# EAGLE design TOPCPCB (EAGLE 9.4.2)
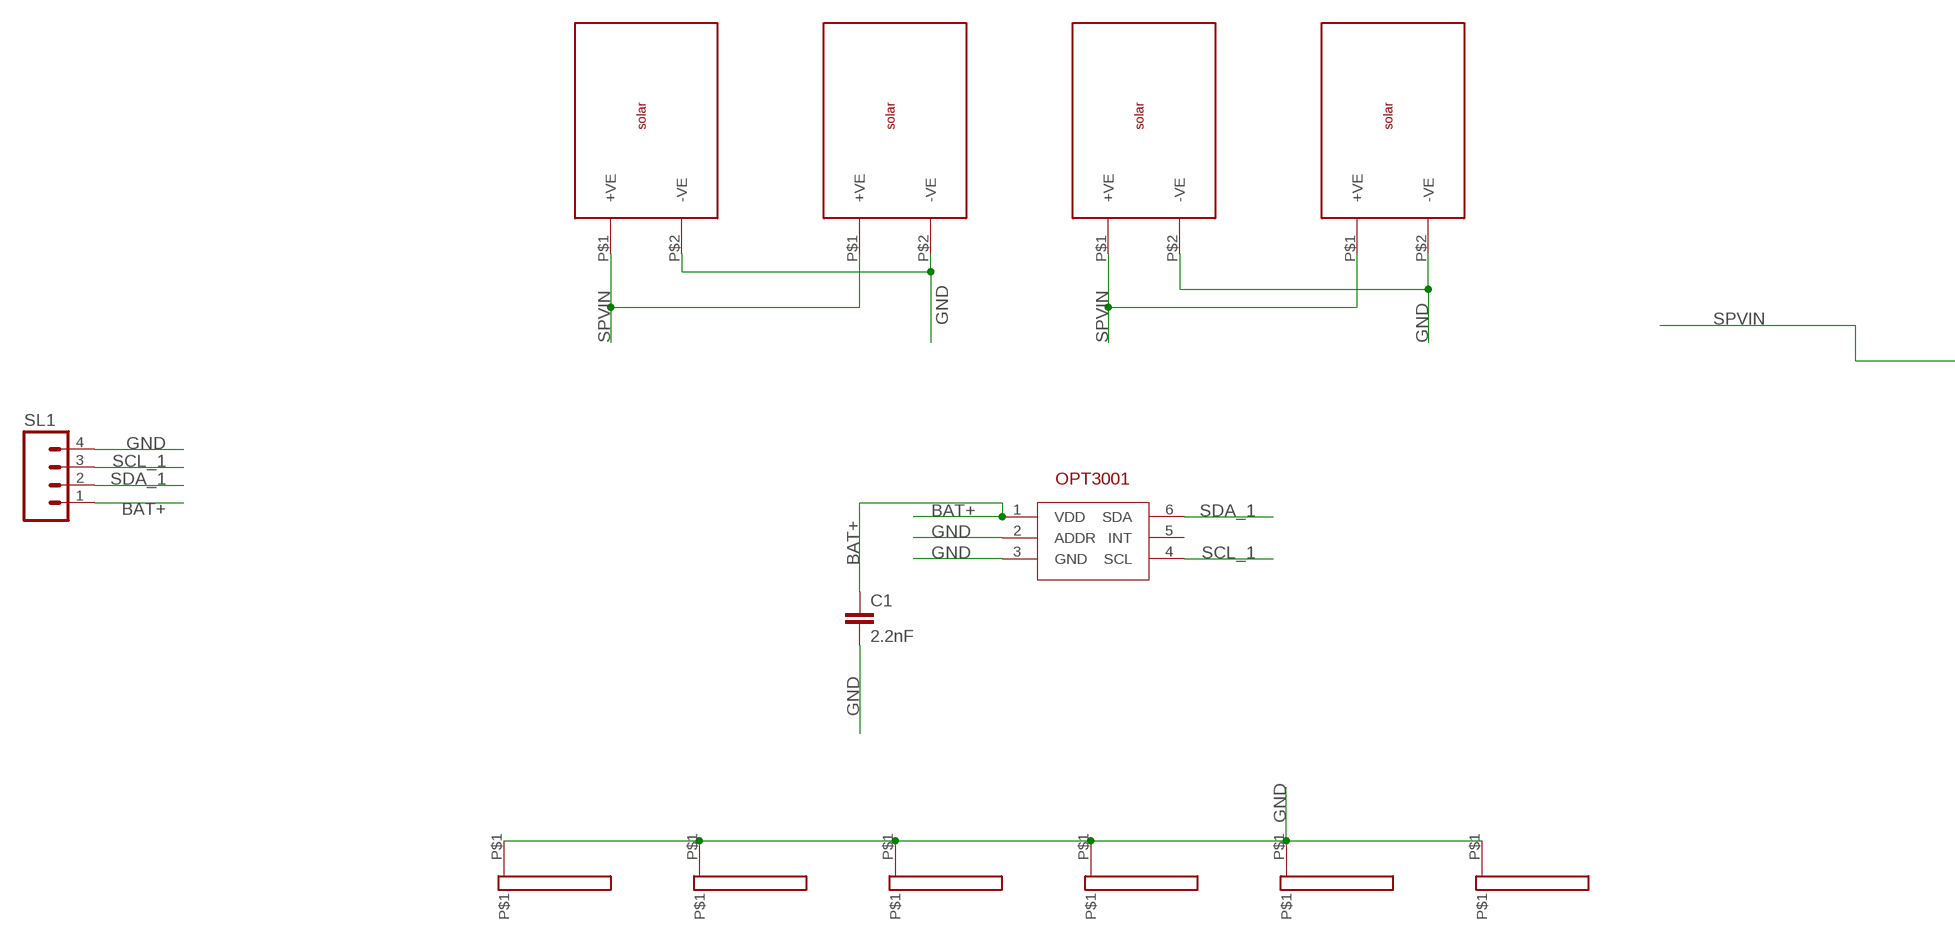
[diagram p0: schematic, sheet 1, part 1 of 2]
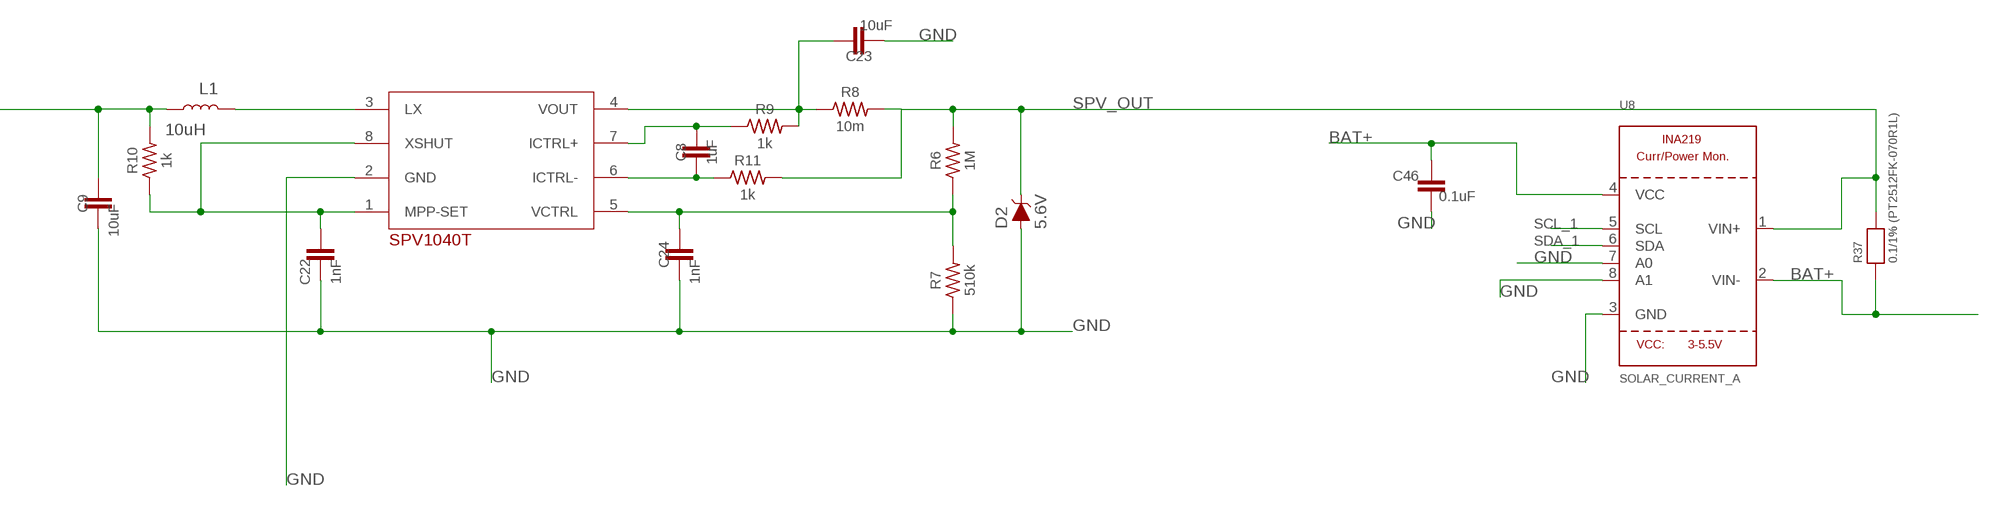
[diagram p1: schematic, sheet 1, part 2 of 2]

## Parts
C1  2.2nF  2.2NF/2200PF-0603-50V-10%  [0603]
C8  1uF  10UF-0603-6.3V-20%  [0603]
C9  10uF  10UF-0603-6.3V-20%  [0603]
C22  1nF  10UF-0603-6.3V-20%  [0603]
C23  10uF  10UF-0603-6.3V-20%  [0603]
C24  1nF  10UF-0603-6.3V-20%  [0603]
C46  0.1uF  10UF-0603-6.3V-20%  [0603]
D2  5.6V  DIODE-ZENER-MMSZ5232BS  [SOD-323]
L1  10uH  INDUCTOR-0603-33NH  [0603]
LEFTSOLD  16X2  [16X2]
R6  1M  RC0603JR-070RL  [RES_0603]
R7  510k  RC0603JR-070RL  [RES_0603]
R8  10m  RC0603JR-070RL  [RES_0603]
R9  1k  RC0603JR-070RL  [RES_0603]
R10  1k  RC0603JR-070RL  [RES_0603]
R11  1k  RC0603JR-070RL  [RES_0603]
R37  0.1/1% (PT2512FK-070R1L)  RESISTOR2512  [2512]
SL1  M04  [04P]
SPV_A  SPV1040T_  [SOP65P640X120-8N]
U1  SON65P200X200X65-7N  [SON65P200X200X65-7N]
U8  SOLAR_CURRENT_A  INA219  [SOT23-8]
U$1  16X2  [16X2]
U$4  16X2  [16X2]
U$5  16X2  [16X2]
U$7  16X2  [16X2]
U$9  16X2  [16X2]
U$10  SOLAR_50_5_2  [FOOT]
U$11  SOLAR_50_5_2  [FOOT]
U$12  SOLAR_50_5_2  [FOOT]
U$13  SOLAR_50_5_2  [FOOT]

## Nets
BAT+: C1.1 C46.1 R37.1 SL1.1 U1.1(VDD) U8.2(VIN-) U8.4(VCC)
GND [vcc]: C1.2 C9.2 C22.2 C23.2 C24.2 C46.2 D2.A LEFTSOLD.P$1 R7.1 SL1.4 SPV_A.2(GND) U1.2(ADDR) U1.3(GND) U8.3(GND) U8.7(A0) U8.8(A1) U$1.P$1 U$4.P$1 U$5.P$1 U$7.P$1 U$9.P$1 U$10.P$2(-VE) U$11.P$2(-VE) U$12.P$2(-VE) U$13.P$2(-VE)
N$5: L1.2 SPV_A.3(LX)
N$31: C22.1 R10.1 SPV_A.1(MPP-SET) SPV_A.8(XSHUT)
N$32: C24.1 R6.1 R7.2 SPV_A.5(VCTRL)
N$34: C8.2 R11.1 SPV_A.6(ICTRL-)
N$35: C8.1 R9.1 SPV_A.7(ICTRL+)
N$36: C23.1 R8.1 R9.2 SPV_A.4(VOUT)
SCL_1: SL1.3 U1.4(SCL) U8.5(SCL)
SDA_1: SL1.2 U1.6(SDA) U8.6(SDA)
SPV_OUT: D2.C R6.2 R8.2 R11.2 R37.2 U8.1(VIN+)
SPVIN: C9.1 L1.1 R10.2 U$10.P$1(+VE) U$11.P$1(+VE) U$12.P$1(+VE) U$13.P$1(+VE)
Unconnected: U1.5(INT)

## Library data of the parts
C1 = SparkFun-Capacitors:2.2NF/2200PF: 2.2nF/2,200pF ceramic capacitors A capacitor is a passive two-terminal electrical component used to store electrical energy temporarily in an electric field.; PROD_ID: CAP-07877
C8 C22 C24 C46 = SparkFun-Capacitors:10UF: 10.0µF ceramic capacitors A capacitor is a passive two-terminal electrical component used to store electrical energy temporarily in an electric field.; PROD_ID: CAP-11015; VALUE: 10uF
C9 C23 = SparkFun-Capacitors:10UF: 10.0µF ceramic capacitors A capacitor is a passive two-terminal electrical component used to store electrical energy temporarily in an electric field.; PROD_ID: CAP-11015
D2 = SparkFun-DiscreteSemi:DIODE-ZENER: Zener Diode A Zener diode allows current to flow from its anode to its cathode like a normal semiconductor diode, but it also permits current to flow in the reverse direction when its "Zener voltage" is reached. - WIkipedia; PROD_ID: DIO-12442
L1 = SparkFun-Coils:INDUCTOR: Inductors Resist changes in electrical current. Basically a coil of wire. SparkFun Products: SparkFun Load Cell Amplifier - HX711 <https://www.sparkfun.com/products/13879> IOIO-OTG - V2.2 <https://www.sparkfun.com/products/13613>; PROD_ID: NDUC-07874; VALUE: 33nH/±5%/500mA
LEFTSOLD U$1 U$4 U$5 U$7 U$9 = 16x2PAD:16X2: Pad for 90 degree solder
R6-R11 = Resistor_Capacitor:RC0603JR-070RL: RES SMD 0 OHM JUMPER 1/10W 0603 Manufacturer's datasheet <http://www.yageo.com/documents/recent/PYu-RC_Group_51_RoHS_L_10.pdf>; CREATED_BY: PCBLayout.com; DIGIKEY_PART_NUMBER: 311-0.0GRTR-ND; MANUFACTURER: Yageo; MPN: RC0603JR-070RL; PACKAGE: SMD 0603
R37 = microbuilder:RESISTOR: Resistors 0402 - 0402 Surface Mount Package 22 Ohm 1% 1/16W [Digikey: 311-22.0LRTR-ND] 33 Ohm 5% 1/16W 1.0K 5% 1/16W 1.5K 5% 1/16W 2.0K 1% 1/16W 10.0K 1% 1/16W [Digikey: 311-10.0KLRTR-ND] 10.0K 5% 1/16W [Digikey: RMCF0402JT10K0TR-ND] 12.1K 1% 1/16W [Digikey: 311-22.0LRTR-ND] 100.0K 5% 1/16W 0603 - 0603 Surface Mount Package 0 Ohm 1/10 Watt 1% Resistor 15 Ohm 1/10 Watt 1% Resistor 33 Ohm 1/10 Watt 1% Resistor 49.9 Ohm 1/10 Watt 1% Resistor 100 Ohm 1/10 Watt 1% Resistor 150 Ohm 1/10 Watt 1% Resistor 240 Ohm 1/10 Watt 1% Resistor 390 Ohm 1/10 Watt 1% Resistor 560 Ohm 1/10 Watt 1% Resistor 680 Ohm 1/10 Watt 1% Resistor 750 Ohm 1/10 Watt 1% Resistor 1.0K Ohm 1/10 Watt 1% Resistor 1.5K Ohm 1/10 Watt 1% Resistor 2.0K Ohm 1/10 Watt 1% Resistor 2.2K Ohm 1/10 Watt 1% Resistor 3.3K Ohm 1/10 Watt 1% Resistor 4.7K Ohm 1/10 Watt 1% Resistor 10.0K Ohm 1/10 Watt 1% Resistor 12.0K Ohm 1/10 Watt 1% Resistor 12.1K Ohm 1/10 Watt 1% Resistor 20.0K Ohm 1/10 Watt 1% Resistor 33.0K Ohm 1/10 Watt 1% Resistor 100.0K Ohm 1/10 Watt 1% Resistor 0805 - 0805 Surface Mount Package 0 Ohm 1/8 Watt 1% Resistor 33 Ohm 1/8 Watt 1% Resistor 100 Ohm 1/8 Watt 1% Resistor 150 Ohm 1/8 Watt 1% Resistor 200 Ohm 1/8 Watt 1% Resistor 240 Ohm 1/8 Watt 1% Resistor 330 Ohm 1/8 Watt 1% Resistor 390 Ohm 1/8 Watt 1% Resistor 470 Ohm 1/8 Watt 1% Resistor 1.0K Ohm 1/8 Watt 1% Resistor 1.5K Ohm 1/8 Watt 1% Resistor 2.0K Ohm 1/8 Watt 1% Resistor 4.7K Ohm 1/8 Watt 1% Resistor 5.1K Ohm 1/8 Watt 1% Resistor 5.6K Ohm 1/8 Watt 1% Resistor 10.0K Ohm 1/8 Watt 1% Resistor 22.0K Ohm 1/8 Watt 1% Resistor 33.0K Ohm 1/8 Watt 1% Resistor 100K Ohm 1/8 Watt 1% Resistor 1206 - 1206 Surface Mount Package 2012 - 2010 Surface Mount Package 0.11 Ohm 1/2 Watt 1% Resistor - Digikey: RHM.11UCT-ND
SL1 = con-amp-quick:M04: AMP QUICK CONNECTOR; OC_FARNELL: unknown; OC_NEWARK: unknown
SPV_A = SPV1040T:SPV1040T_
U1 = SON65P200X200X65-7N:SON65P200X200X65-7N; A_MAX: 0.65; B_MAX: 0.3; B_MIN: 0.2; B_NOM: 0.25; D2_NOM: 1.35; D_MAX: 2.075; D_MIN: 1.925; D_NOM: 2.0; E2_NOM: 0.65; ENOM: 0.65; E_MAX: 2.075; E_MIN: 1.925; E_NOM: 2.0; L_MAX: 0.35; L_MIN: 0.25; L_NOM: 0.3; MANUFACTURER: Maxim Integrated; PIN_COUNT: 6.0; SNAPEDA_PACKAGE_ID: 71138; STANDARD: IPC 7351B
U8 = microbuilder:INA219: INA219 - I2C Current/Power Monitor Voltage Range: 0-26V Accuracy: 0.5% Temperature: -40°C - 125°C
U$10-U$13 = solar_50_5_2:SOLAR_50_5_2

## Net classes
1 vcc: width 0.254 mm

## Board
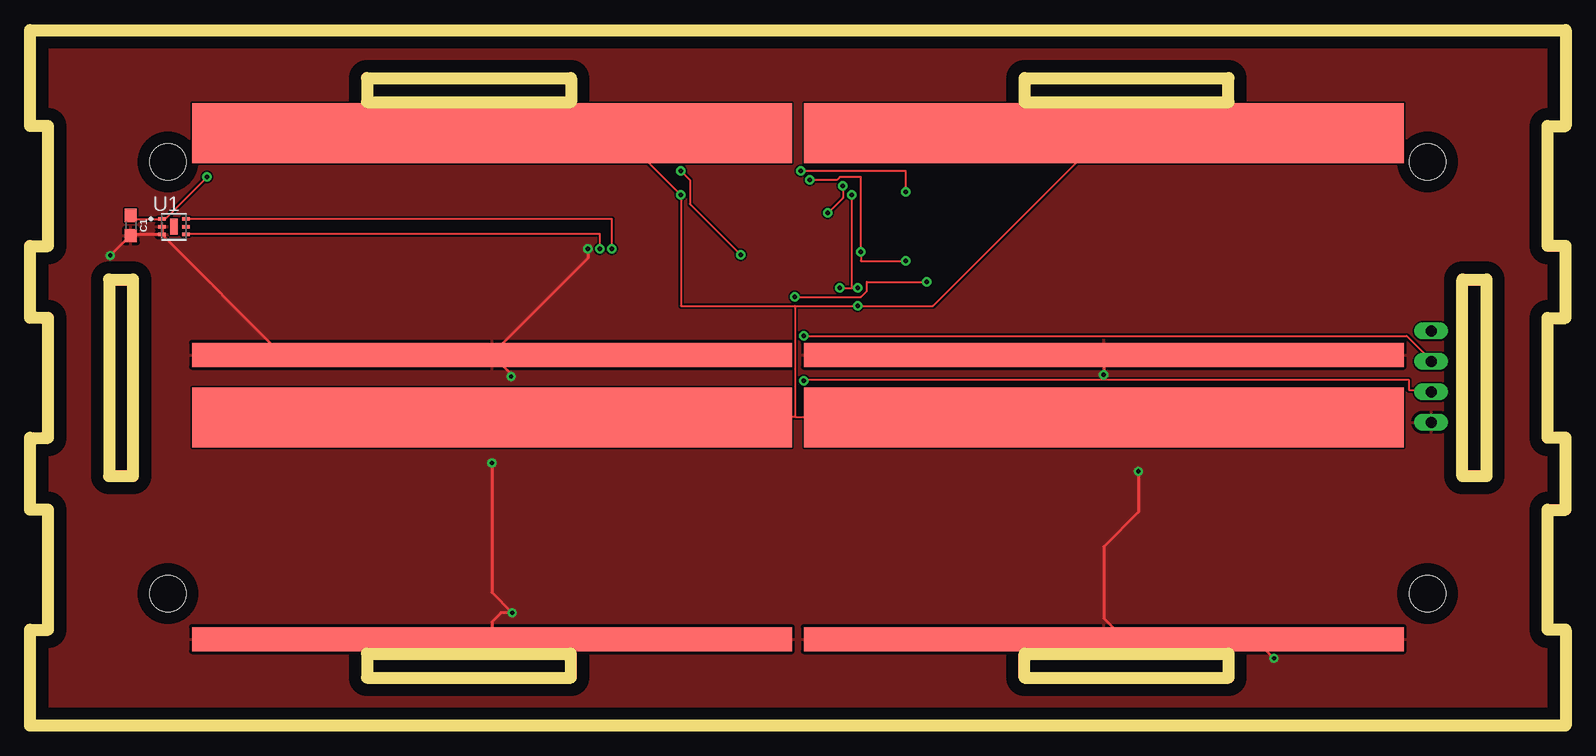
[diagram p2: board, top side]
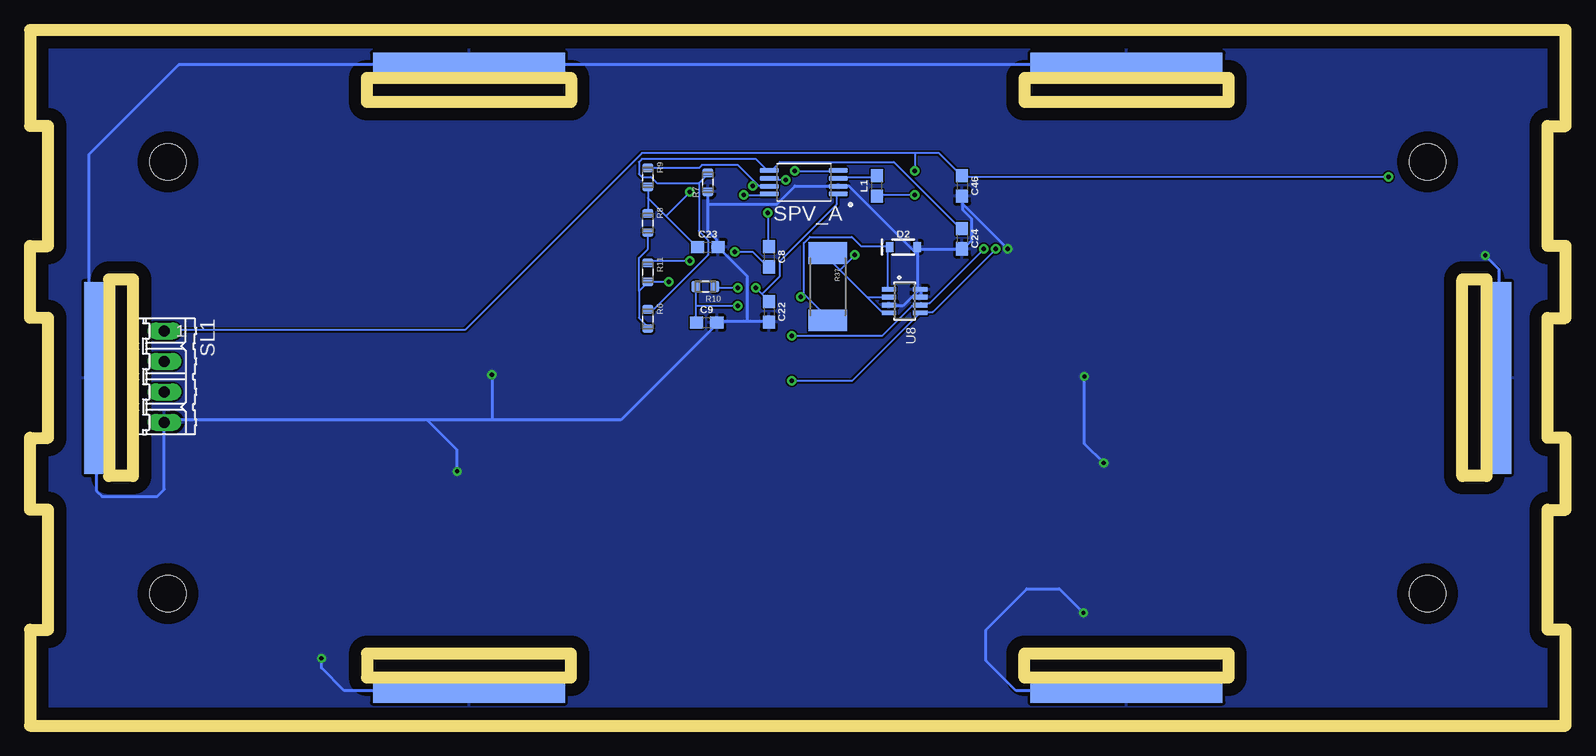
[diagram p3: board, bottom side, seen from below]

Size 128 x 58 mm. Coordinates in mm from the lower left corner, seen from the top.
Outline: 0,0 0,8 1.5,8 1.5,18 0,18 0,24 1.5,24 1.5,34 0,34 0,40 1.5,40 1.5,50 0,50 0,58 128,58 128,50 126.5,50 126.5,40 128,40 128,34 126.5,34 126.5,24 128,24 128,18 126.5,18 126.5,8 128,8 128,0 0,0
Outline: 8.6,20.8 8.6,37.2 6.6,37.2 6.6,20.8 8.6,20.8
Outline: 119.4,20.8 119.4,37.2 121.4,37.2 121.4,20.8 119.4,20.8
Outline: 82.9,52 99.9,52 99.9,54 82.9,54 82.9,52
Outline: 28.1,6 45.1,6 45.1,4 28.1,4 28.1,6
Outline: 82.9,6 99.9,6 99.9,4 82.9,4 82.9,6
Outline: 28.1,54 45.1,54 45.1,52 28.1,52 28.1,54
Copper layers (1*16): Top 0.035mm / dielectric 1.5mm / Bottom 0.035mm
Design rules "default": minimum track width 6mil, minimum drill 0.35mm, track to track 6mil, track to pad 6mil, pad to pad 6mil, via to via 6mil, smd to smd 6mil, copper to edge 40mil, drill to drill 6mil, minimum pad ring 10mil, minimum via ring 8mil, stop-mask expansion 4mil, vias tented up to drill 0mil, thermal gap 10mil
Holes 3 mm at 11.5,47 11.5,11 116.5,11 116.5,47

### Footprints (pad centres in the part's own frame; a part is rotated, then mirrored left to right if it is on the bottom)
0603 = smd 1.1 x 1: 1 -0.85,0; 2 0.85,0
SOD-323 = smd 0.63 x 0.83: A 1.15,0; C -1.15,0
16X2 = smd 16 x 2: P$1 0,0
RES_0603 = smd 0.74 x 0.93: 1 -0.795,0; 2 0.795,0
2512 = smd 1.8 x 3.2: 1 -2.8,0; 2 2.8,0
04P = drill 0.914 long: 1 -3.81,0; 2 -1.27,0; 3 1.27,0; 4 3.81,0
SOP65P640X120-8N = smd 1.56 x 0.41: 1 -2.88,0.975; 2 -2.88,0.325; 3 -2.88,-0.325; 4 -2.88,-0.975; 5 2.88,-0.975; 6 2.88,-0.325; 7 2.88,0.325; 8 2.88,0.975
SON65P200X200X65-7N = smd 0.72 x 0.27: 1 -0.995,0.65; 2 -0.995,0; 3 -0.995,-0.65; 4 0.995,-0.65; 5 0.995,0; 6 0.995,0.65 | smd 0.65 x 1.35: 7 0,0
SOT23-8 = smd 0.4 x 1.2: 1 -0.975,-1.3; 2 -0.325,-1.3; 3 0.325,-1.3; 4 0.975,-1.3; 5 0.975,1.3; 6 0.325,1.3; 7 -0.325,1.3; 8 -0.975,1.3
FOOT = smd 50 x 5: P$1 0,0 | smd 50 x 2: P$2 0,18.5

### Placement (x,y rotation side)
C1  8.4,41.7 270 top
C8  66.4,39.1 270 bottom
C9  71.6,33.6 0 bottom
C22  66.4,34.5 270 bottom
C23  71.5,39.9 0 bottom
C24  50.3,40.6 270 bottom
C46  50.3,45 270 bottom
D2  55.2,39.9 0 bottom
L1  57.4,45 90 bottom
LEFTSOLD  5.53,28.99 270 bottom
R6  76.5,33.9 270 bottom
R7  71.5,45.3 90 bottom
R8  76.5,41.9 270 bottom
R9  76.5,45.7 270 bottom
R10  71.7,36.6 180 bottom
R11  76.5,37.8 270 bottom
R37  61.5,36.6 270 bottom
SL1  116.8,29.1 270 bottom
SPV_A  63.5,45.3 180 bottom
U1  12,41.6 0 top
U8  55.1,35.4 270 bottom
U$1  122.47,28.99 270 bottom
U$4  36.6,2.9 0 bottom
U$5  36.6,55.1 0 bottom
U$7  91.4,2.9 0 bottom
U$9  91.4,55.1 0 bottom
U$10  38.5,49.4 180 top
U$11  38.5,25.7 180 top
U$12  89.5,49.4 180 top
U$13  89.5,25.7 180 top

### Tracks (layer width: path | path; a pad name or v marks a point on that pad's centre or on a via)
BAT+  (via drill 0.35)
  Top 0.152: C1.1 8.5,42.5 8.5,42.25 U1.1 11.25,42.25 v14.75,45.75 | v59.25,39.25 55,43.5 55,45.5 v54.25,46.25
  Bottom 0.152: 60.5,38 61.5,39 R37.1 | 60.5,38 58.25,35.75 | 58.25,35.75 57,34.5 56.5,34.5 U8.4 | 58.25,35.75 56.5,35.75 U8.2 | v14.75,45.75 50.25,45.75 C46.1 50.5,46 52.25,47.75 54.25,47.75 | 54.25,47.75 77,47.75 91.75,33 116.75,33 SL1.1 | v59.25,39.25 60.5,38 | 54.25,47.75 v54.25,46.25
GND  (via drill 0.35)
  Top 0.254: 11,41 11,41.5 U1.2 | 11,41 8.5,41 C1.2 8.35,40.85 v6.7,39.2 | 11,41 U1.3 20.95,31 38.5,31 | U$12.P$2 v89.5,29.25 | 38.5,31 46.5,39 v46.5,39.75 | 38.5,31 U$10.P$2 40.1,29.3 v40.1,29.1 | v38.5,21.9 38.5,11.1 v40.2,9.4 39.26,9.4 38.5,8.64 38.5,7.9 38.5,7.64 | v103.7,5.6 101.66,7.64 90.8,7.64 | 90.8,7.64 89.5,7.64 U$13.P$2 | v92.4,21.2 92.4,17.8 89.5,14.9 89.5,8.94 90.8,7.64 | 38.5,7.64 38.4,7.64 | U$11.P$2 38.5,7.64
  Bottom 0.254: 54,39.25 54,36.5 U8.8 | 54,39.25 54,39.75 | 54,39.75 C24.2 50.25,39.75 49.5,40.5 49.5,42.25 50.25,43 50.25,43.5 | 54,39.75 D2.A | 50.25,43.5 50.25,44 C46.2 | U8.7 53.75,35.75 53.75,36.25 U8.8 | U8.3 56.25,35 55.25,35 54,36.25 U8.8 | 54,39.25 59.75,45 60.5,45 SPV_A.2 60.75,45 64.25,45 65.75,43.5 71.5,43.5 | 68.25,33.75 70.75,33.75 C9.2 70.75,33.5 78.75,25.5 89.5,25.5 | 68.25,33.75 66.5,33.75 C22.2 | 71.5,43.5 71.5,41.25 70.75,40.5 70.75,40 C23.2 68.25,37.5 68.25,33.75 | 71.5,43.5 R7.1 | 89.5,25.5 94.9,25.5 | 94.9,25.5 116.75,25.5 SL1.4 116.8,19.7 117.4,19.1 122,19.1 122.47,19.57 U$1.P$1 123.04,28.99 123.04,47.66 115.6,55.1 U$9.P$1 U$5.P$1 | v89.5,29.25 89.5,25.5 | 50.25,43.5 v46.5,39.75 | v38.5,21.9 40.1,23.5 v40.1,29.1 | v92.4,21.2 92.4,23 94.9,25.5 | LEFTSOLD.P$1 5.53,38.03 v6.7,39.2 | U$4.P$1 45.8,2.9 48.3,5.4 48.3,8 44.9,11.4 42.2,11.4 v40.2,9.4 | U$7.P$1 101.8,2.9 103.7,4.8 v103.7,5.6
  pour Top: 1.5,0 1.5,58 126.5,58 126.5,50.1 126.5,0
  pour Bottom: 1.5,0 1.5,58 126.5,58 126.5,0
N$5
  Bottom 0.152: L1.2 57.5,45.75 60.5,45.75 SPV_A.3
N$31  (via drill 0.35)
  Top 0.152: v67.5,36.5 68.5,36.5 | 68.5,36.5 v69,36.5 | 68.5,36.5 v68.5,44.25
  Bottom 0.152: v69,36.5 70.75,36.5 R10.1 | 67,36 66.5,35.5 C22.1 | 67,36 v67.5,36.5 | 67,36 65.5,37.5 65.5,38.75 60.75,43.5 60.75,44.25 SPV_A.1 | v68.5,44.25 66.5,44.25 SPV_A.8
N$32
  Bottom 0.152: 72.25,45.25 72.25,41.25 71.5,40.5 71.5,39.25 76,34.75 76.5,34.75 R6.1 | 72.25,45.25 71.5,46 R7.2 | C24.1 50.5,41.5 56,47 65.5,47 66.25,46.25 SPV_A.5 66.5,46.25 67.5,47.25 77,47.25 77.25,47 77.25,46 77,45.75 76.25,45.75 75.75,45.25 72.25,45.25
N$34  (via drill 0.35)
  Top 0.152: v73,38.75 69.25,38.75 v69.25,39.5 69.25,45.75 67.5,45.75 67.25,45.5 v65,45.5
  Bottom 0.152: v73,38.75 76.5,38.75 R11.1 | v69.25,39.5 67.75,39.5 66.5,38.25 C8.2 | v65,45.5 66.25,45.5 SPV_A.6
N$35  (via drill 0.35)
  Top 0.152: v66.5,42.75 67.75,44 v67.75,45
  Bottom 0.152: 67.5,45.25 67.25,45 66.5,45 SPV_A.7 | 67.5,45.25 69,46.75 72,46.75 72.25,46.5 R9.1 | v66.5,42.75 66.5,40 C8.1 | 67.5,45.25 v67.75,45
N$36  (via drill 0.35)
  Top 0.152: v64.25,46.25 73,46.25 v73,44.5
  Bottom 0.152: R9.2 76.5,44 | 76.5,44 R8.1 | 76.5,44 75,42.5 | 75,42.5 72.5,40 C23.1 | v64.25,46.25 60.75,46.25 SPV_A.4 | 75,42.5 v73,44.5
SCL_1  (via drill 0.35)
  Top 0.152: v47.5,39.75 47.5,41 13,41 U1.4 | v64.5,28.75 64.55,28.8 114.95,28.8 114.95,28 116.75,28 SL1.3
  Bottom 0.152: v47.5,39.75 52.75,34.5 53.75,34.5 U8.5 54,34.25 59.5,28.75 v64.5,28.75
SDA_1  (via drill 0.35)
  Top 0.152: U1.6 48.5,42.25 v48.5,39.75 | v64.5,32.5 114.75,32.5 116.75,30.5 SL1.2
  Bottom 0.152: v48.5,39.75 53,35.25 53.75,35.25 U8.6 54,35 54.5,35 57,32.5 v64.5,32.5
SPV_OUT  (via drill 0.35)
  Top 0.152: v74.75,37 69.75,37 69.75,36.25 69.25,35.75 v63.75,35.75
  Bottom 0.152: 77.25,36.25 77.25,34 76.5,33.25 R6.2 | R11.2 77.25,36.25 | R8.2 76.5,39.75 77.25,39 77.25,36.25 | U8.1 56.5,36.5 56.5,39.75 D2.C 56.5,40 58.75,40 59.5,40.75 63,40.75 63.5,40.25 63.5,36 | 63.5,36 61.5,34 R37.2 | v74.75,37 R11.2 | 63.5,36 v63.75,35.75 | R11.2
SPVIN  (via drill 0.35)
  Top 0.152: U$10.P$1 38.5,49.25 49.25,49.25 v54.25,44.25 54.25,35 63.75,35 | 63.75,35 v69,35 75.25,35 89.5,49.25 U$12.P$1 | 63.75,25.75 38.5,25.75 U$11.P$1 | 63.75,35 63.75,25.75 | 63.75,25.75 89.5,25.75 U$13.P$1
  Bottom 0.152: 72.5,35 72.5,33.75 C9.1 | 72.5,35 72.5,36.5 R10.2 | v54.25,44.25 57.25,44.25 L1.1 | v69,35 72.5,35